# Altium project di2_motor.PrjPCB
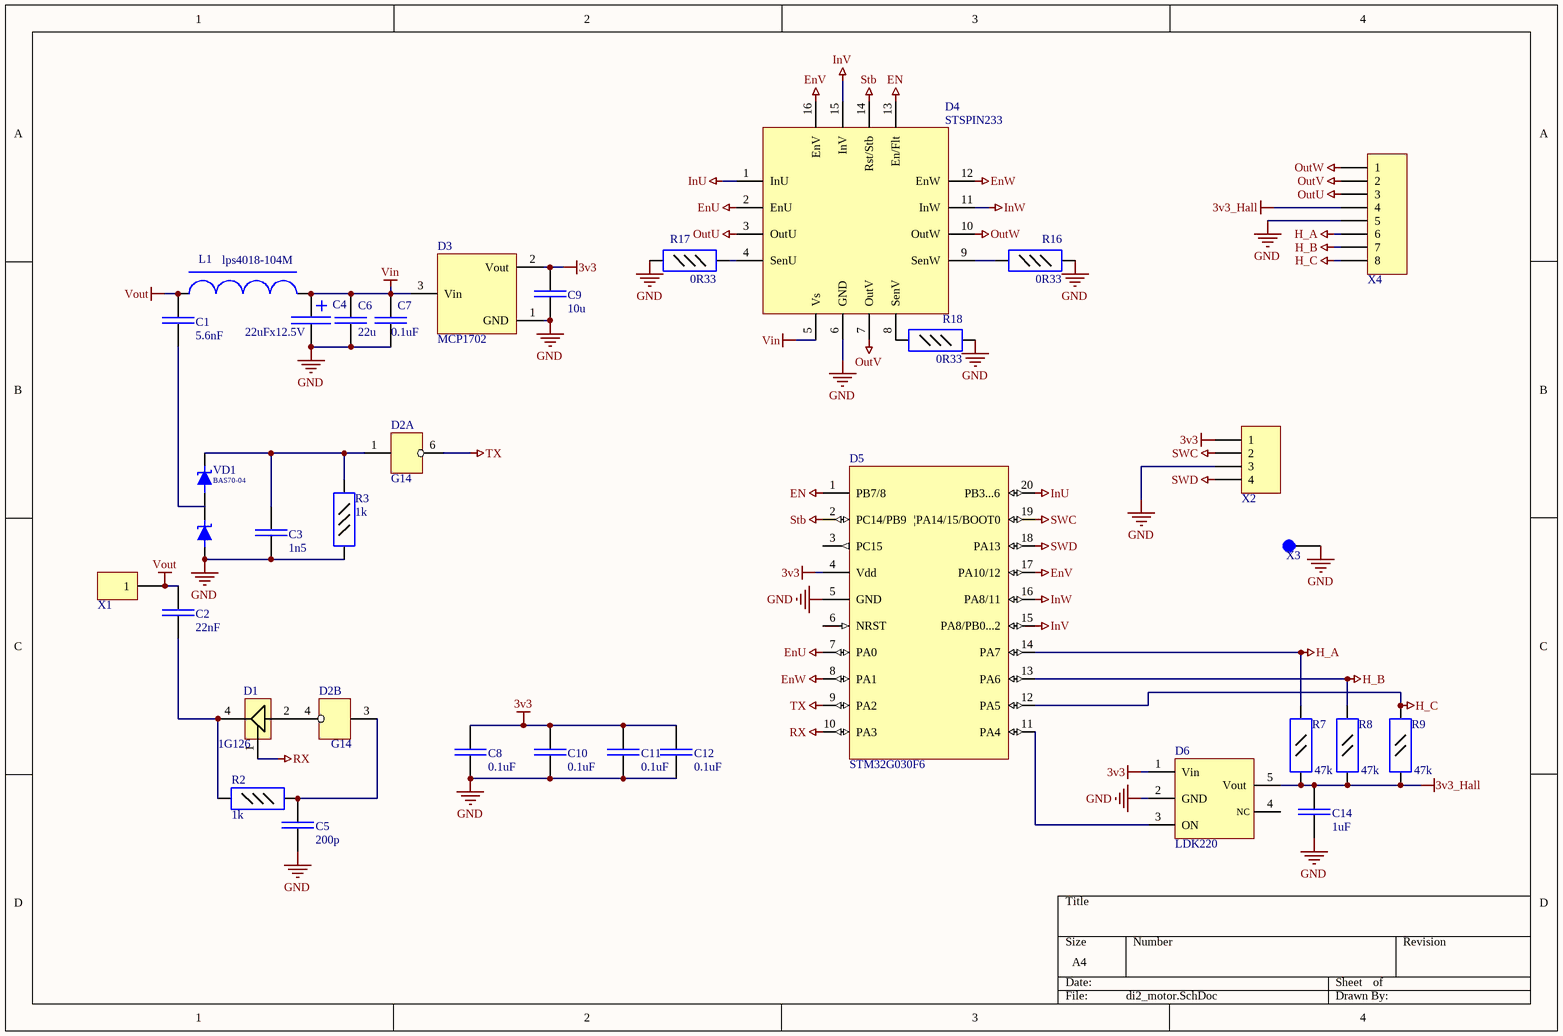
[diagram p0: di2_motor.SchDoc]
1 sheet, 33 parts. Net scope: global (net labels, ports and power ports of the same name join across sheets).
Board file: di2_motor.PcbDoc

## Sheet di2_motor.SchDoc
size A4

### Parts
C1  5.6nF  [C0603]
C2  22nF  [C0603]
C3  1n5  [C0603]
C4  value 22uFx12.5V  [К53-56(4)]  (hidden comment: К53-56)
C5  200p  [C0603]
C6  22u  [C0805]
C7  0.1uF  [C0603]
C8  0.1uF  [C0603]
C9  10u  [C0603]
C10  0.1uF  [C0603]
C11  0.1uF  [C0603]
C12  0.1uF  [C0603]
C14  1uF  [C0603]
D1  1G126  [SOT23-5]
D2  G14  [SOT23-6]  (parts A,B of 2)
D3  MCP1702  [SOT23]
D4  STSPIN233  [VFQFPN16L]
D5  STM32G030F6  [tssop20]
D6  LDK220  [SOT353]
L1  lps4018-104M  [SRR4018]
R2  1k  [R0603]
R3  1k  [R0603]
R7  47k  [R0603]
R8  47k  [R0603]
R9  47k  [R0603]
R16  0R33  [R1206]
R17  0R33  [R1206]
R18  0R33  [R1206]
VD1  BAS70-04  [SOT23]
X1  PLS-1  [PLS-1.5]  (value not drawn)
X2  PLS-4-1.27  [PLS-4-1.27]  (value not drawn)
X3  XS  [1.0x1.5]  (value not drawn)  (no BOM)
X4  PLS-8-2R  [PLS-8-1.27]  (value not drawn)

### Nets
3v3: C8.1 C9.1 C10.1 C11.1 C12.1 D1.5(VCC) D2.5(Vcc) D3.2(Vout) D5.4(Vdd) D6.1(Vin) X2.1
3v3_Hall: C14.1 D6.5(Vout) R7.2 R8.2 R9.2 X4.4
EN: D4.13(En/Flt) D5.1(PB7/8)
EnU: D4.2(EnU) D5.7(PA0)
EnV: D4.16(EnV) D5.17(PA10/12)
EnW: D4.12(EnW) D5.8(PA1)
GND: C3.2 C4.2 C5.2 C6.2 C7.2 C8.2 C9.2 C10.2 C11.2 C12.2 C14.2 D1.3(GND) D2.2(GND) D3.1(GND) D4.6(GND) D4.17(EPAD) D5.5(GND) D6.2(GND) R3.2 R16.2 R17.1 R18.2 VD1.1(A) X2.3 X3.1 X4.5
H_A: D5.14(PA7) R7.1 X4.6
H_B: D5.13(PA6) R8.1 X4.7
H_C: D5.12(PA5) R9.1 X4.8
InU: D4.1(InU) D5.20(PB3...6)
InV: D4.15(InV) D5.15(PA8/PB0...2)
InW: D4.11(InW) D5.16(PA8/11)
OutU: D4.3(OutU) X4.3
OutV: D4.7(OutV) X4.2
OutW: D4.10(OutW) X4.1
RX: D1.1 D5.10(PA3)
Stb: D4.14(Rst/Stb) D5.2(PC14/PB9)
SWC: D5.19(|PA14/15/BOOT0) X2.2
SWD: D5.18(PA13) X2.4
TX: D2.6 D5.9(PA2)
Vin: C4.1 C6.1 C7.1 D3.3(Vin) D4.5(Vs) L1.2
Vout: C1.1 C2.1 L1.1 X1.1
NetC1_2: C1.2 VD1.3(A/C)
NetC2_2: C2.2 D1.4 R2.1
NetC3_1: C3.1 D2.1 R3.1 VD1.2(C)
NetC5_1: C5.1 D2.3 R2.2
NetD1_2: D1.2 D2.4
NetD4_4: D4.4(SenU) R17.2
NetD4_8: D4.8(SenV) R18.1
NetD4_9: D4.9(SenW) R16.1
NetD5_11: D5.11(PA4) D6.3(ON)

Not connected (* = marked no-connect by the designer): D5 3(PC15) 6(NRST); D6 4(NC)

### Library data of the parts
C1-C3 C5-C12 C14 = К10-69в: чип-конденсатор
C4 = К53-56: чип-конденсатор танталовый
D1 = SN74LVC1G126: Буфер
D2 = SN74LVC2G14: Триггер шмидта
D3 = MCP1702: LDO uPower regulator 250mA
D4 = STSPIN233: 1.3A BLDC motor driver
D5 = STM32G030F6: STM32 ARM-based 32-bit MCU with 23 Kbytes Flash, 20-pin TSSOP
D6 = LP2985: LDO linear regulator 150mA
L1 = ДМ: дросель ДМ; Value: *
R2 R3 R16-R18 = Р1-16П-0,062: чип-резистор 0805, 2.1х1.3 мм, 0.062 Вт; Value: 82K
R7-R9 = Р1-12-0,125: чип-резистор 0805, 2.1х1.3 мм, 0.125 Вт
VD1 = BAS70-04: SMD-SOT23 70V 0.2A 5nS; Price: 0.08
X1 = PLS-1: Header, 1-Pin; LatestRevisionDate: 17-Jul-2002; LatestRevisionNote: Re-released for DXP Platform.; Publisher: Altium Limited
X3 = XS: контакт